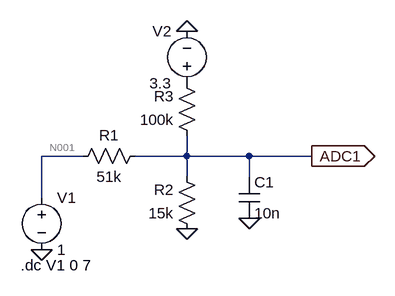
[diagram p0: schematic Tension.asc]
Tension.asc, the LTspice schematic file:
Version 4
SHEET 1 880 680
WIRE 112 64 48 64
WIRE 272 64 272 32
WIRE 272 64 192 64
WIRE 368 64 272 64
WIRE 464 64 368 64
WIRE 272 96 272 64
WIRE 368 96 368 64
WIRE 48 128 48 64
FLAG 48 208 0
FLAG 272 176 0
FLAG 368 160 0
FLAG 272 -128 0
FLAG 464 64 ADC1
IOPIN 464 64 Out
SYMBOL voltage 48 112 R0
WINDOW 123 0 0 Left 0
WINDOW 39 0 0 Left 0
SYMATTR InstName V1
SYMATTR Value 1
SYMBOL res 208 48 R90
WINDOW 0 0 56 VBottom 2
WINDOW 3 32 56 VTop 2
SYMATTR InstName R1
SYMATTR Value 51k
SYMBOL res 288 192 R180
WINDOW 0 36 76 Left 2
WINDOW 3 36 40 Left 2
SYMATTR InstName R2
SYMATTR Value 15k
SYMBOL res 288 48 R180
WINDOW 0 36 76 Left 2
WINDOW 3 36 40 Left 2
SYMATTR InstName R3
SYMATTR Value 100k
SYMBOL cap 352 96 R0
SYMATTR InstName C1
SYMATTR Value 10n
SYMBOL voltage 272 -32 R180
WINDOW 0 24 96 Left 2
WINDOW 3 24 16 Left 2
WINDOW 123 0 0 Left 0
WINDOW 39 0 0 Left 0
SYMATTR InstName V2
SYMATTR Value 3.3
TEXT 16 232 Left 2 !.dc V1 0 7

The netlist it stands for:
* Tension.asc
V1 N001 0 1
R1 ADC1 N001 51k
R2 0 ADC1 15k
R3 ADC1 P001 100k
C1 ADC1 0 10n
V2 P001 0 3.3
.dc V1 0 7
.backanno
.end

* Results of the author's LTspice run, read from the files saved beside the schematic
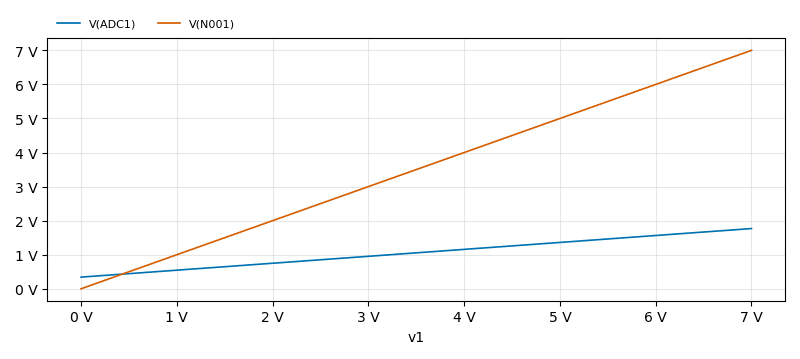
[diagram p1: DC transfer characteristic of Tension.asc, plotted from the saved traces]
* DC transfer characteristic, 1 run:
*   V(ADC1): 342.8 mV at v1=0 V, 1.768 V at v1=7 V, min 342.8 mV, max 1.768 V
*   V(N001): 0 V at v1=0 V, 7 V at v1=7 V, min 0 V, max 7 V